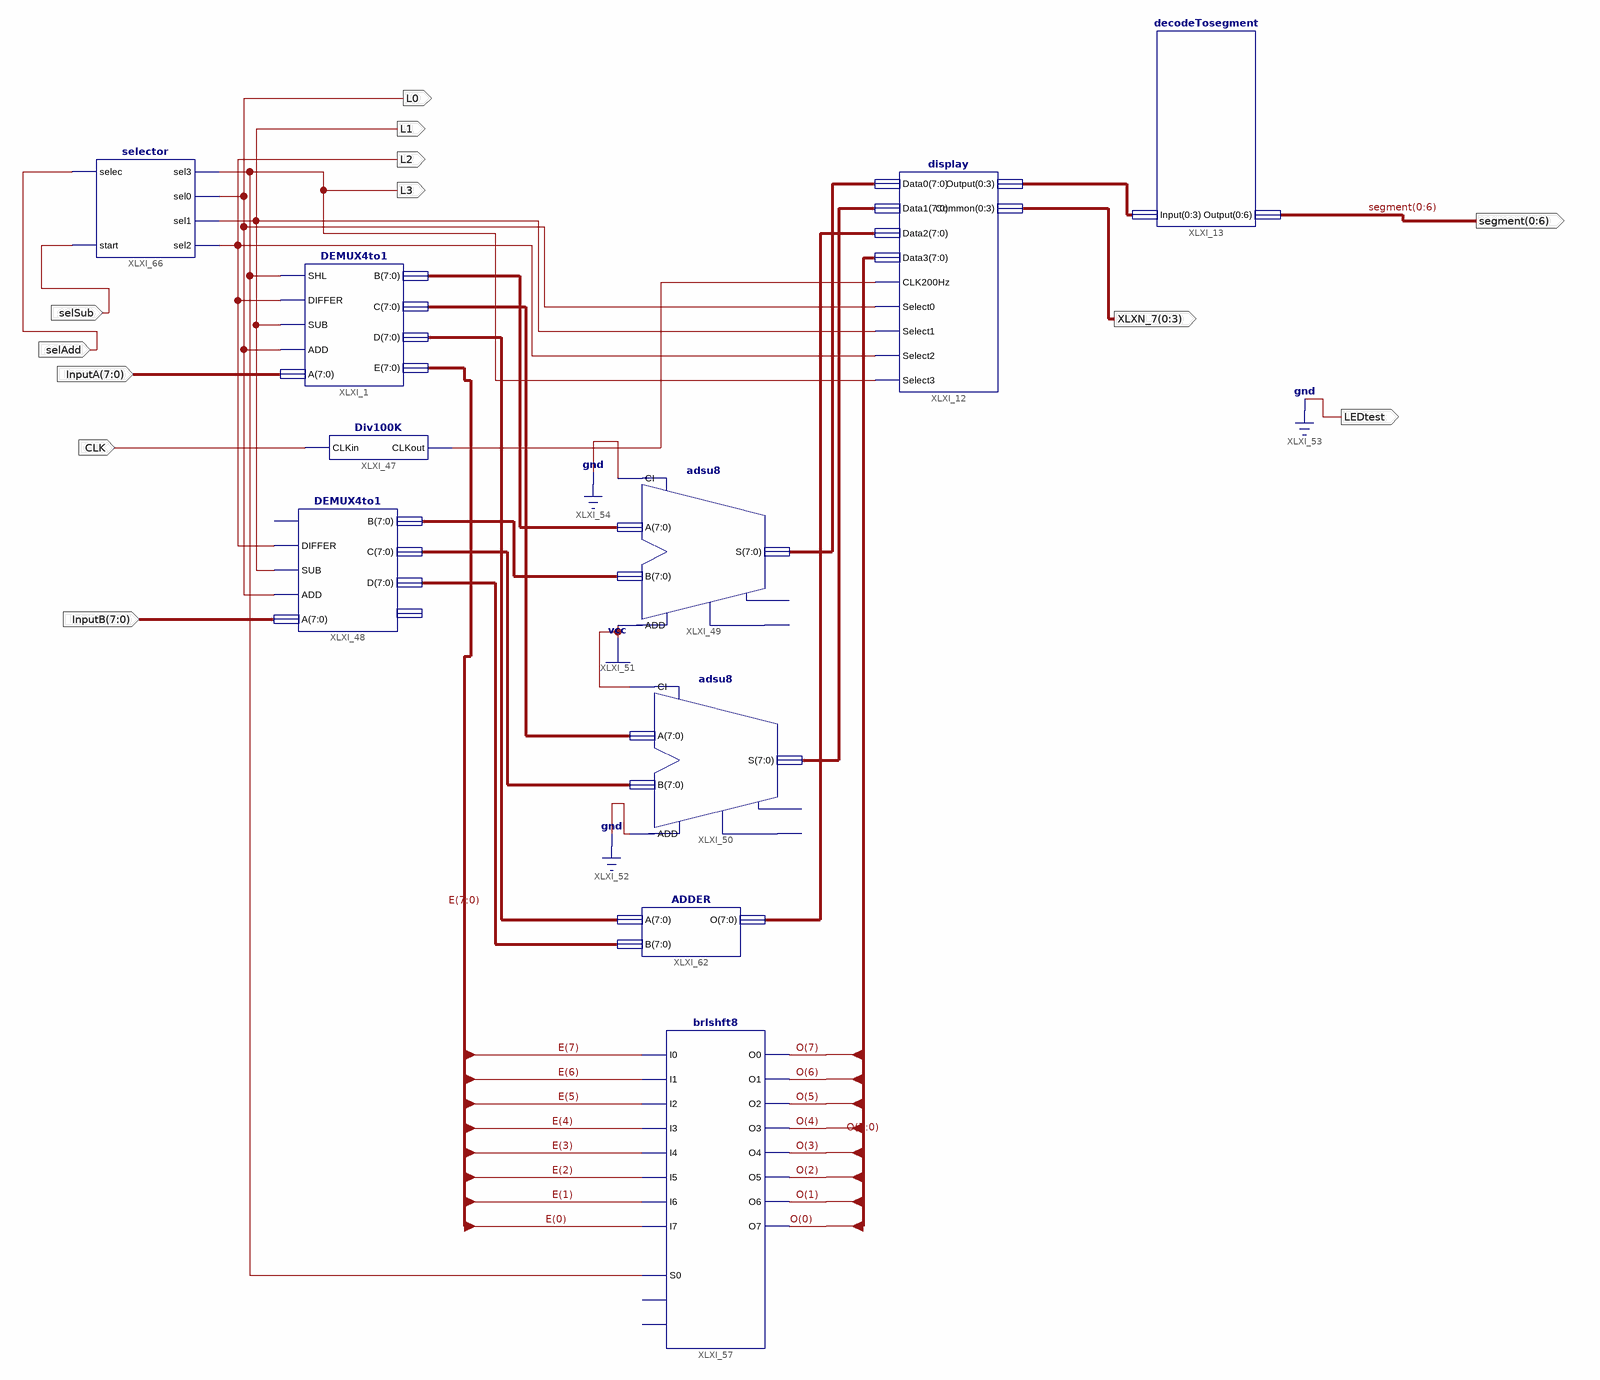
[diagram p0: schematic sheet 1]
// Xilinx ISE schematic ALULab.sch (spartan6) as structural Verilog: 10 symbols, 12 ports
module ALULab (
  input  CLK,
  input  [7:0] InputA,
  input  [7:0] InputB,
  input  selAdd,
  input  selSub,
  output [0:6] segment,
  output [0:3] XLXN_7,
  output LEDtest,
  output L3,
  output L0,
  output L1,
  output L2
);

  wire XLXN_174;
  wire [3:0] XLXN_5;
  wire [7:0] E, O, XLXN_104, XLXN_105, XLXN_106, XLXN_107, XLXN_110, XLXN_111, XLXN_129, XLXN_130, XLXN_131;

  DEMUX4to1 XLXI_1 (
    .SHL(L3), .DIFFER(L2), .SUB(L1), .ADD(L0), .A(InputA), .B(XLXN_104), .C(XLXN_105), .D(XLXN_129), .E(E));
  display XLXI_12 (
    .Data0(XLXN_110), .Data1(XLXN_111), .Data2(XLXN_131), .Data3(O), .Select0(L0), .Select3(L3),
    .Select2(L2), .Select1(L1), .CLK200Hz(XLXN_174), .Output({XLXN_5[0], XLXN_5[1], XLXN_5[2], XLXN_5[3]}),
    .Common(XLXN_7));
  decodeTosegment XLXI_13 (.Input({XLXN_5[0], XLXN_5[1], XLXN_5[2], XLXN_5[3]}), .Output(segment));
  Div100K XLXI_47 (.CLKin(CLK), .CLKout(XLXN_174));
  DEMUX4to1 XLXI_48 (
    .DIFFER(L2), .SUB(L1), .ADD(L0), .A(InputB), .B(XLXN_106), .C(XLXN_107), .D(XLXN_130));  // open: SHL, E
  adsu8 XLXI_49 (.A(XLXN_104), .ADD(1'b1), .B(XLXN_106), .CI(1'b0), .S(XLXN_110));  // open: CO, OFL
  adsu8 XLXI_50 (.A(XLXN_105), .ADD(1'b0), .B(XLXN_107), .CI(1'b1), .S(XLXN_111));  // open: CO, OFL
  brlshft8 XLXI_57 (
    .I0(E[7]), .I1(E[6]), .I2(E[5]), .I3(E[4]), .I4(E[3]), .I5(E[2]), .I6(E[1]), .I7(E[0]), .S0(L3),
    .O0(O[7]), .O1(O[6]), .O2(O[5]), .O3(O[4]), .O4(O[3]), .O5(O[2]), .O6(O[1]), .O7(O[0]));  // open: S1, S2
  ADDER XLXI_62 (.A(XLXN_129), .B(XLXN_130), .O(XLXN_131));
  selector XLXI_66 (.selec(selAdd), .start(selSub), .sel3(L3), .sel0(L0), .sel1(L1), .sel2(L2));

  assign LEDtest = 1'b0;
endmodule
